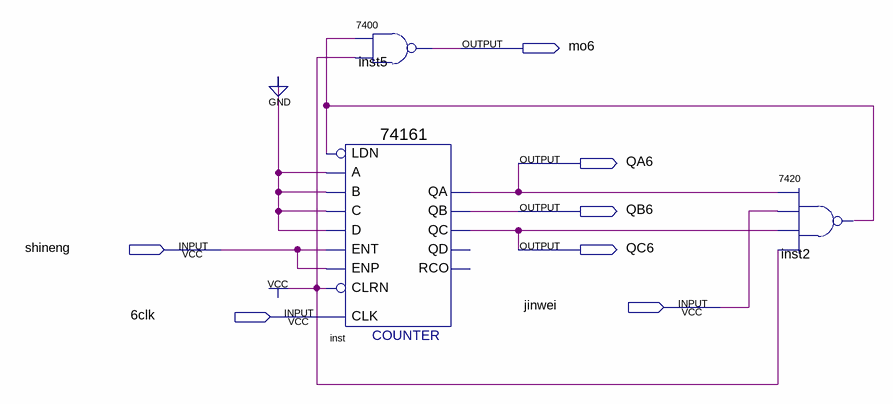
[diagram p0: schematic sheet]
// Quartus schematic mo6tongbu.bdf as structural Verilog: 3 symbols, 7 pins
module mo6tongbu (
  input  shineng,
  input  jinwei,
  input  \6clk ,
  output mo6,
  output QA6,
  output QB6,
  output QC6
);

  wire inst2_1;

  \74161  inst (
    .CLRN(1'b1), .CLK(\6clk ), .ENP(shineng), .LDN(inst2_1), .A(1'b0), .D(1'b0), .ENT(shineng), .B(1'b0),
    .C(1'b0), .QC(QC6), .QB(QB6), .QA(QA6));  // open: QD, RCO
  \7400  inst5 (.\3 (1'b1), .\2 (inst2_1), .\1 (mo6));
  \7420  inst2 (.\4 (QC6), .\2 (QA6), .\3 (jinwei), .\5 (1'b1), .\1 (inst2_1));
endmodule
